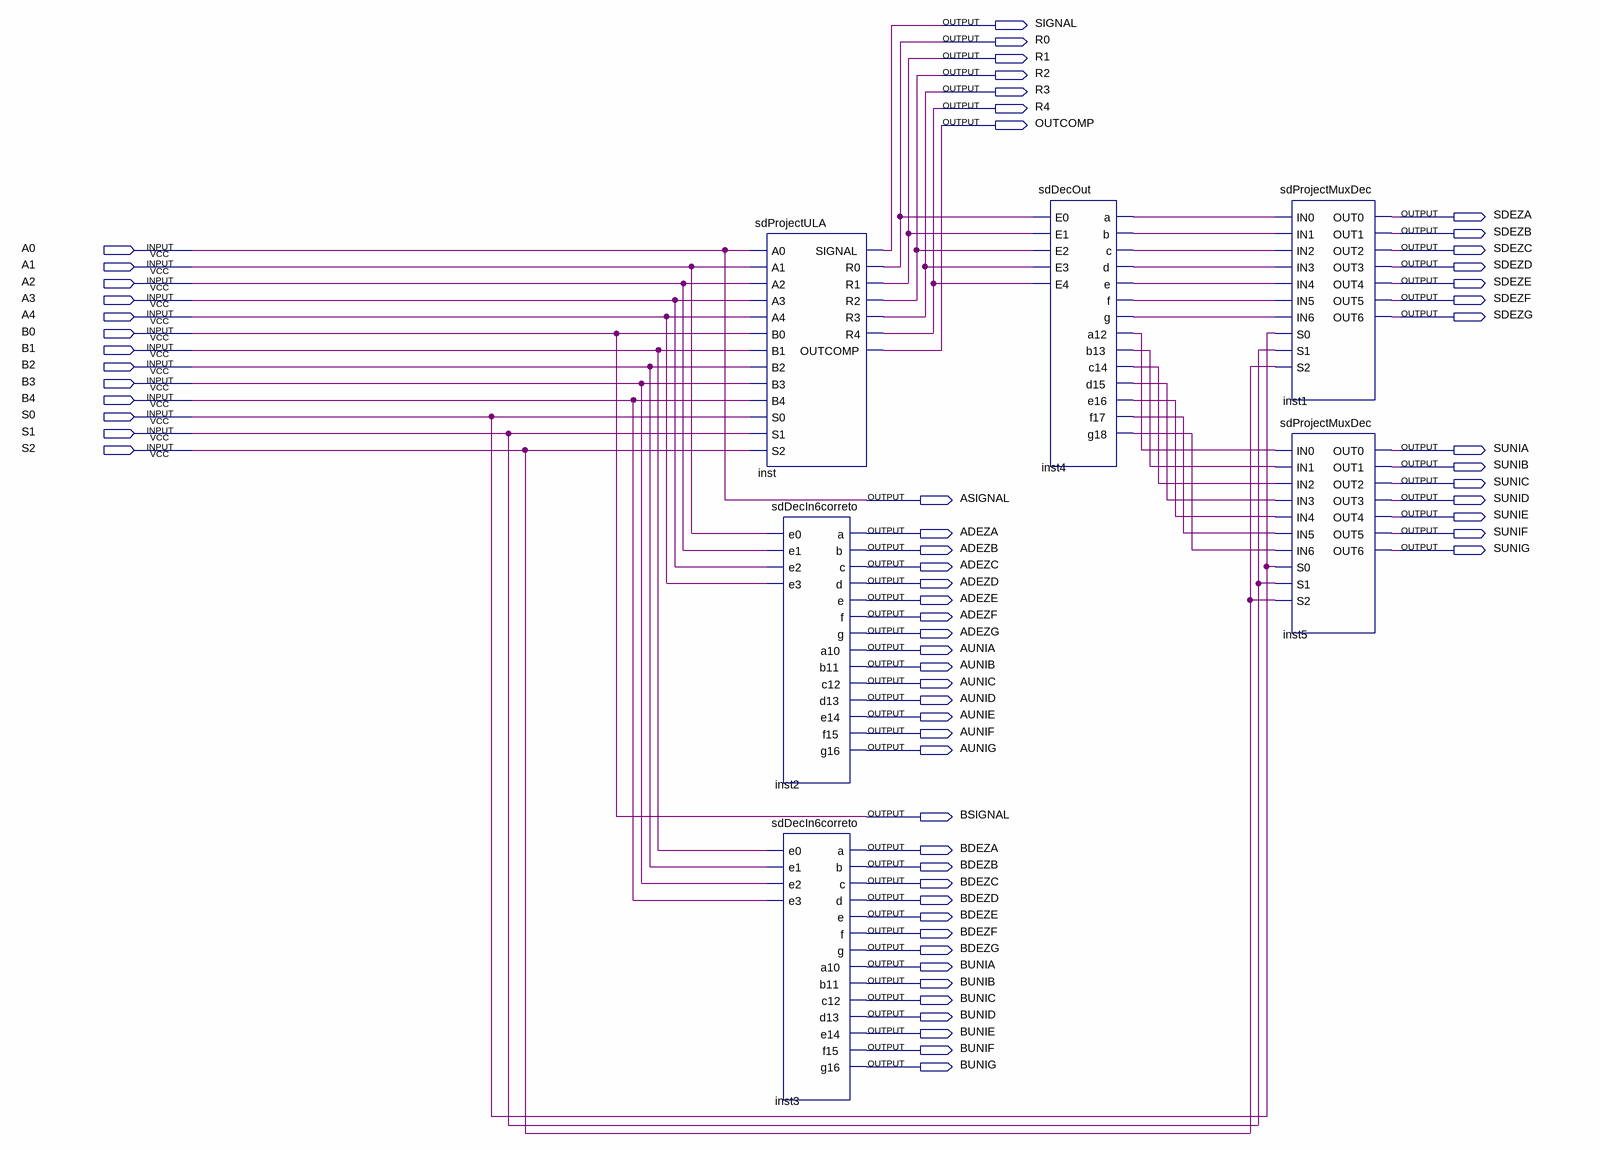
[diagram p0: schematic sheet]
// Quartus schematic sdProjectMain.bdf as structural Verilog: 6 symbols, 64 pins
module sdProjectMain (
  input  A0,
  input  A1,
  input  A2,
  input  A3,
  input  A4,
  input  B0,
  input  B1,
  input  B2,
  input  B3,
  input  B4,
  input  S0,
  input  S1,
  input  S2,
  output SIGNAL,
  output R0,
  output R1,
  output R2,
  output R3,
  output R4,
  output OUTCOMP,
  output SDEZA,
  output SDEZB,
  output SDEZC,
  output SDEZD,
  output SDEZE,
  output SDEZF,
  output SDEZG,
  output SUNIA,
  output SUNIB,
  output SUNIC,
  output ASIGNAL,
  output SUNID,
  output SUNIE,
  output ADEZA,
  output SUNIF,
  output ADEZB,
  output SUNIG,
  output ADEZC,
  output ADEZD,
  output ADEZE,
  output ADEZF,
  output ADEZG,
  output AUNIA,
  output AUNIB,
  output AUNIC,
  output AUNID,
  output AUNIE,
  output AUNIF,
  output AUNIG,
  output BSIGNAL,
  output BDEZA,
  output BDEZB,
  output BDEZC,
  output BDEZD,
  output BDEZE,
  output BDEZF,
  output BDEZG,
  output BUNIA,
  output BUNIB,
  output BUNIC,
  output BUNID,
  output BUNIE,
  output BUNIF,
  output BUNIG
);

  wire inst4_a, inst4_a12, inst4_b, inst4_b13, inst4_c, inst4_c14, inst4_d, inst4_d15, inst4_e, inst4_e16,
       inst4_f, inst4_f17, inst4_g, inst4_g18;

  sdProjectULA inst (
    .A0(A0), .A1(A1), .A2(A2), .A3(A3), .A4(A4), .B0(B0), .B1(B1), .B2(B2), .B3(B3), .B4(B4), .S0(S0),
    .S1(S1), .S2(S2), .SIGNAL(SIGNAL), .R0(R0), .R1(R1), .R2(R2), .R3(R3), .R4(R4), .OUTCOMP(OUTCOMP));
  sdDecIn6correto inst2 (
    .e0(A1), .e1(A2), .e2(A3), .e3(A4), .a(ADEZA), .b(ADEZB), .c(ADEZC), .d(ADEZD), .e(ADEZE), .f(ADEZF),
    .g(ADEZG), .a10(AUNIA), .b11(AUNIB), .c12(AUNIC), .d13(AUNID), .e14(AUNIE), .f15(AUNIF), .g16(AUNIG));
  sdDecIn6correto inst3 (
    .e0(B1), .e1(B2), .e2(B3), .e3(B4), .a(BDEZA), .b(BDEZB), .c(BDEZC), .d(BDEZD), .e(BDEZE), .f(BDEZF),
    .g(BDEZG), .a10(BUNIA), .b11(BUNIB), .c12(BUNIC), .d13(BUNID), .e14(BUNIE), .f15(BUNIF), .g16(BUNIG));
  sdDecOut inst4 (
    .E0(R0), .E1(R1), .E2(R2), .E3(R3), .E4(R4), .a(inst4_a), .b(inst4_b), .c(inst4_c), .d(inst4_d),
    .e(inst4_e), .f(inst4_f), .g(inst4_g), .a12(inst4_a12), .b13(inst4_b13), .c14(inst4_c14),
    .d15(inst4_d15), .e16(inst4_e16), .f17(inst4_f17), .g18(inst4_g18));
  sdProjectMuxDec inst1 (
    .IN0(inst4_a), .IN1(inst4_b), .IN2(inst4_c), .IN3(inst4_d), .IN4(inst4_e), .IN5(inst4_f), .IN6(inst4_g),
    .S0(S0), .S1(S1), .S2(S2), .OUT0(SDEZA), .OUT1(SDEZB), .OUT2(SDEZC), .OUT3(SDEZD), .OUT4(SDEZE),
    .OUT5(SDEZF), .OUT6(SDEZG));
  sdProjectMuxDec inst5 (
    .IN0(inst4_a12), .IN1(inst4_b13), .IN2(inst4_c14), .IN3(inst4_d15), .IN4(inst4_e16), .IN5(inst4_f17),
    .IN6(inst4_g18), .S0(S0), .S1(S1), .S2(S2), .OUT0(SUNIA), .OUT1(SUNIB), .OUT2(SUNIC), .OUT3(SUNID),
    .OUT4(SUNIE), .OUT5(SUNIF), .OUT6(SUNIG));

  assign ASIGNAL = A0;
  assign BSIGNAL = B0;
endmodule
